# EAGLE design SilovaCast (EAGLE 6.3)
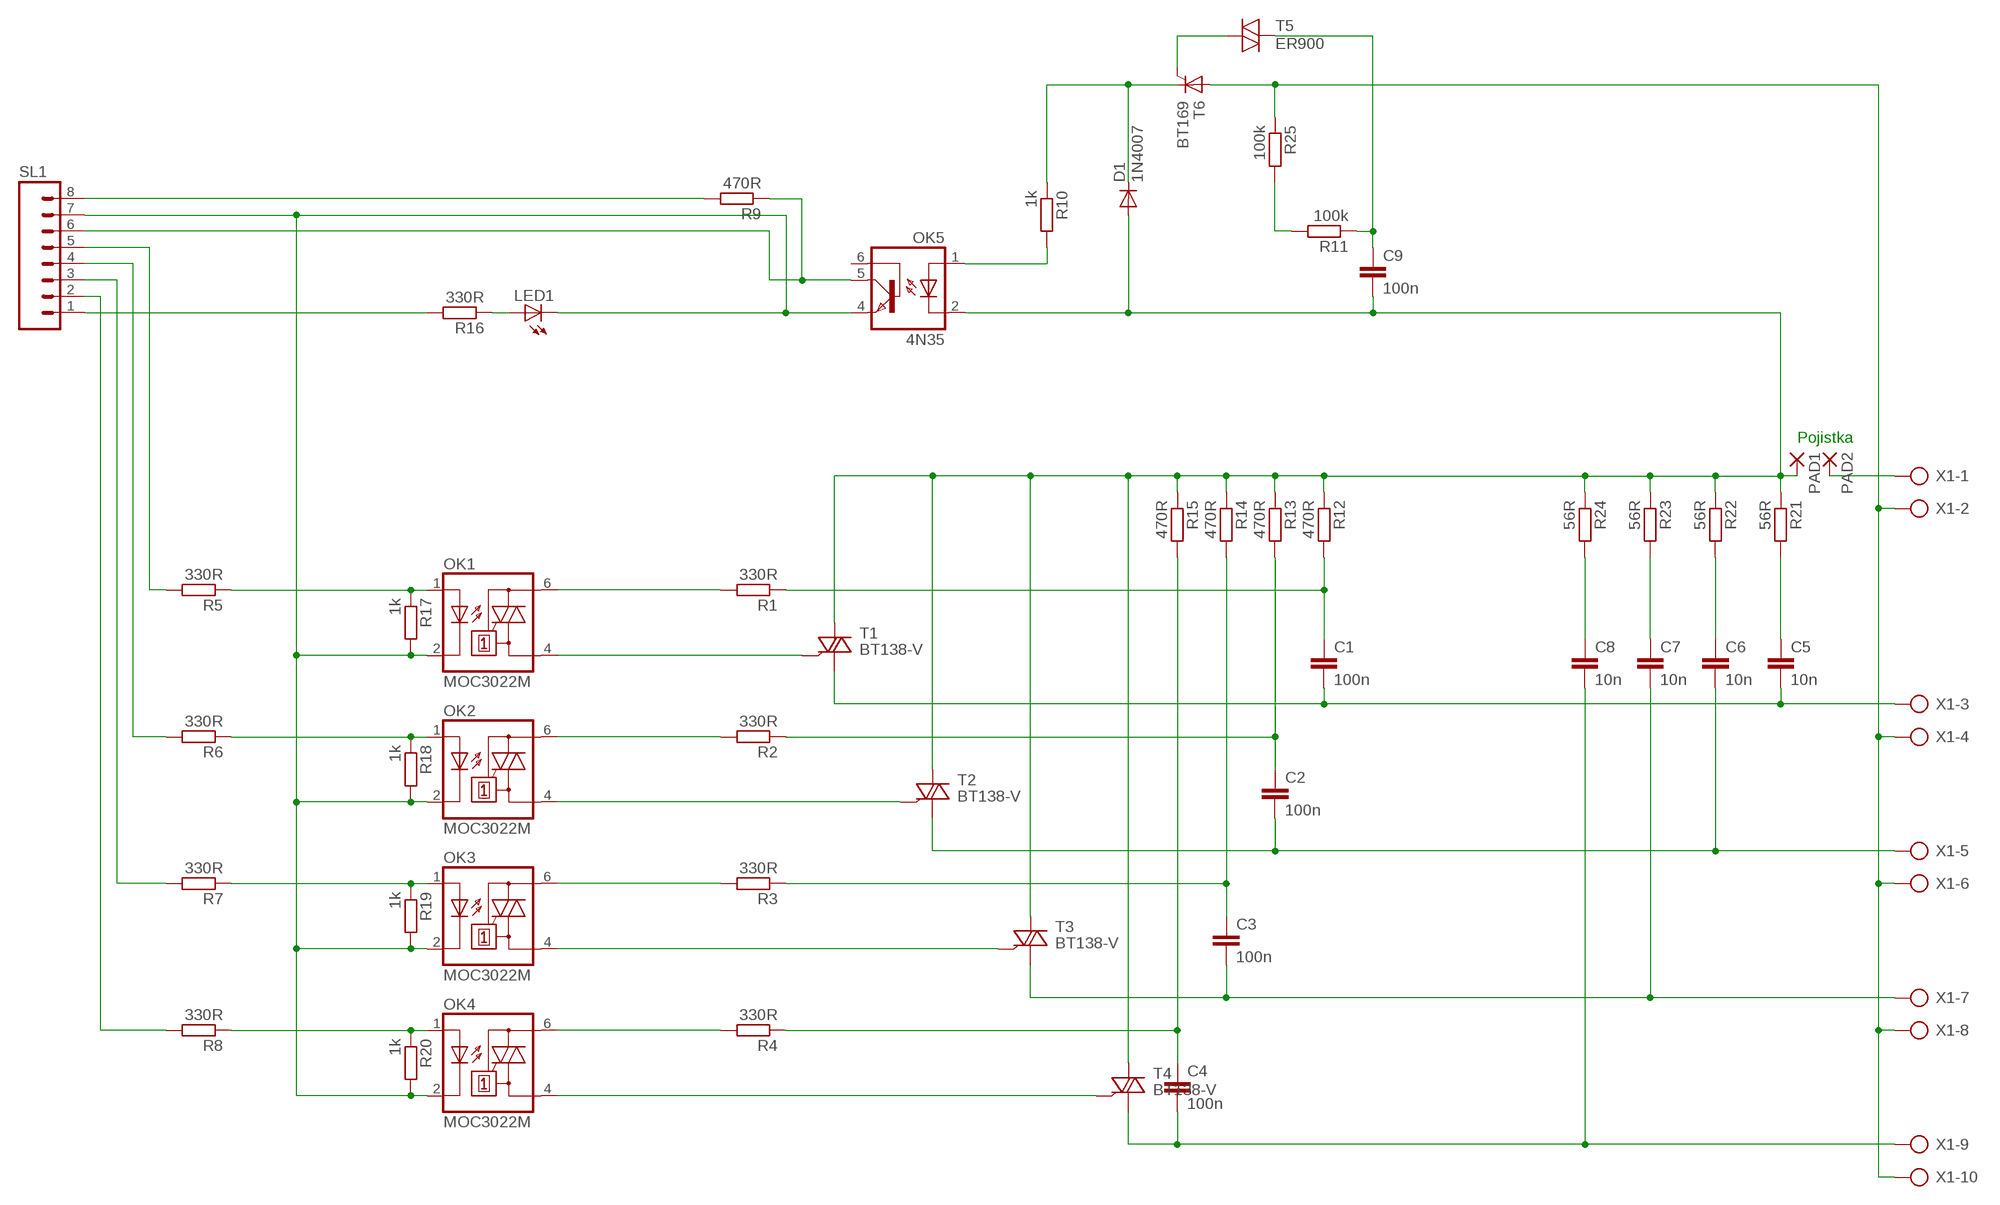
[diagram p0: schematic, sheet 1]

## Parts
C1  100n  C7.5/6  [C7.5B6]
C2  100n  C7.5/6  [C7.5B6]
C3  100n  C7.5/6  [C7.5B6]
C4  100n  C7.5/6  [C7.5B6]
C5  10n  C7.5/6  [C7.5B6]
C6  10n  C7.5/6  [C7.5B6]
C7  10n  C7.5/6  [C7.5B6]
C8  10n  C7.5/6  [C7.5B6]
C9  100n  C7.5/6  [C7.5B6]
D1  1N4007  1N4004  [DO41-10]
LED1  LED5MM  [LED5MM]
OK1  MOC3022M  [DIL06]
OK2  MOC3022M  [DIL06]
OK3  MOC3022M  [DIL06]
OK4  MOC3022M  [DIL06]
OK5  4N35  [DIL06]
PAD1  3,17/1,3  [3,17/1,3]
PAD2  3,17/1,3  [3,17/1,3]
R1  330R  R-EU_0207/12  [0207/12]
R2  330R  R-EU_0207/12  [0207/12]
R3  330R  R-EU_0207/12  [0207/12]
R4  330R  R-EU_0207/12  [0207/12]
R5  330R  R-EU_R0805  [R0805]
R6  330R  R-EU_R0805  [R0805]
R7  330R  R-EU_R0805  [R0805]
R8  330R  R-EU_R0805  [R0805]
R9  470R  R-EU_0207/12  [0207/12]
R10  1k  R-EU_0207/12  [0207/12]
R11  100k  R-EU_0207/12  [0207/12]
R12  470R  R-EU_0207/12  [0207/12]
R13  470R  R-EU_0207/12  [0207/12]
R14  470R  R-EU_0207/12  [0207/12]
R15  470R  R-EU_0207/12  [0207/12]
R16  330R  R-EU_0207/12  [0207/12]
R17  1k  R-EU_R0805  [R0805]
R18  1k  R-EU_R0805  [R0805]
R19  1k  R-EU_R0805  [R0805]
R20  1k  R-EU_R0805  [R0805]
R21  56R  R-EU_0411/15  [0411/15]
R22  56R  R-EU_0411/15  [0411/15]
R23  56R  R-EU_0411/15  [0411/15]
R24  56R  R-EU_0411/15  [0411/15]
R25  100k  R-EU_0207/12  [0207/12]
SL1  M08  [08P]
T1  BT138-V  [TO220BV]
T2  BT138-V  [TO220BV]
T3  BT138-V  [TO220BV]
T4  BT138-V  [TO220BV]
T5  ER900  [ER900]
T6  BT169  [TO92-2]
X1  AK300/10  [AK300/10]

## Nets
L: C9.2 D1.A OK5.2(C) PAD1.1(P) R12.1 R13.1 R14.1 R15.1 R21.1 R22.1 R23.1 R24.1 T1.T2(A2) T2.T2(A2) T3.T2(A2) T4.T2(A2)
N$1: C3.2 C7.2 T3.T1(A1) X1.7
N$2: C4.2 C8.2 T4.T1(A1) X1.9
N$3: C2.2 C6.2 T2.T1(A1) X1.5
N$4: OK3.4(A1) T3.G
N$5: OK4.4(A1) T4.G
N$6: OK2.4(A1) T2.G
N$7: OK1.4(A1) T1.G
N$8: C1.2 C5.2 T1.T1(A1) X1.3
N$9: OK1.6(A2) R1.2
N$10: OK2.6(A2) R2.2
N$11: OK3.6(A2) R3.2
N$12: OK4.6(A2) R4.2
N$13: T5.1 T6.G
N$14: C9.1 R11.1 T5.2
N$15: OK5.1(A) R10.2
N$16: PAD2.1(P) X1.1
N$17: R9.2 SL1.8
N$18: D1.C R10.1 T6.C
N$19: R11.2 R25.2
N$20: C2.1 R2.1 R13.2
N$21: C3.1 R3.1 R14.2
N$22: OK5.5(COL) R9.1 SL1.6
N$23: LED1.K(C) OK1.2(C) OK2.2(C) OK3.2(C) OK4.2(C) OK5.4(EMI) R17.2 R18.2 R19.2 R20.2 SL1.7
N$24: OK1.1(A) R5.1 R17.1
N$25: OK2.1(A) R6.1 R18.1
N$26: OK3.1(A) R7.1 R19.1
N$27: OK4.1(A) R8.1 R20.1
N$28: R5.2 SL1.5
N$29: R6.2 SL1.4
N$30: R7.2 SL1.3
N$31: R8.2 SL1.2
N$32: C4.1 R4.1 R15.2
N$33: C1.1 R1.1 R12.2
N$34: R16.2 SL1.1
N$35: LED1.A R16.1
N$36: C5.1 R21.2
N$37: C6.1 R22.2
N$38: C7.1 R23.2
N$39: C8.1 R24.2
N_PEN: R25.1 T6.A X1.2 X1.4 X1.6 X1.8 X1.10
Unconnected: OK5.6(BAS)

## Notes on the sheet
- Pojistka

## Library data of the parts
C1-C9 = capacitor-wima:C: CAPACITOR naming: grid - package width
D1 = diode:1N4004: DIODE general purpose rectifier, 1 A
LED1 = led:LED: LED OSRAM: - CHIPLED LG R971, LG N971, LY N971, LG Q971, LY Q971, LO R971, LY R971 LH N974, LH R974 LS Q976, LO Q976, LY Q976 LO Q996 - Hyper CHIPLED LW Q18S LB Q993, LB Q99A, LB R99A - SideLED LS A670, LO A670, LY A670, LG A670, LP A670 LB A673, LV A673, LT A673, LW A673 LH A674 LY A675 LS A676, LA A676, LO A676, LY A676, LW A676 LS A679, LY A679, LG A679 - Hyper Micro SIDELED® LS Y876, LA Y876, LO Y876, LY Y876 LT Y87S - SmartLED LW L88C, LW L88S LB L89C, LB L89S, LG L890 LS L89K, LO L89K, LY L89K LS L896, LA L896, LO L896, LY L896 - TOPLED LS T670, LO T670, LY T670, LG T670, LP T670 LSG T670, LSP T670, LSY T670, LOP T670, LYG T670 LG T671, LOG T671, LSG T671 LB T673, LV T673, LT T673, LW T673 LH T674 LS T676, LA T676, LO T676, LY T676, LB T676, LH T676, LSB T676, LW T676 LB T67C, LV T67C, LT T67C, LS T67K, LO T67K, LY T67K, LW E67C LS E67B, LA E67B, LO E67B, LY E67B, LB E67C, LV E67C, LT E67C LW T67C LS T679, LY T679, LG T679 LS T770, LO T770, LY T770, LG T770, LP T770 LB T773, LV T773, LT T773, LW T773 LH T774 LS E675, LA E675, LY E675, LS T675 LS T776, LA T776, LO T776, LY T776, LB T776 LHGB T686 LT T68C, LB T68C - Hyper Mini TOPLED® LB M676 - Mini TOPLED Santana® LG M470 LS M47K, LO M47K, LY M47K Source: http://www.osram.convergy.de LUXEON: - LUMILED® LXK2-PW12-R00, LXK2-PW12-S00, LXK2-PW14-U00, LXK2-PW14-V00 LXK2-PM12-R00, LXK2-PM12-S00, LXK2-PM14-U00 LXK2-PE12-Q00, LXK2-PE12-R00, LXK2-PE12-S00, LXK2-PE14-T00, LXK2-PE14-U00 LXK2-PB12-K00, LXK2-PB12-L00, LXK2-PB12-M00, LXK2-PB14-N00, LXK2-PB14-P00, LXK2-PB14-Q00 LXK2-PR12-L00, LXK2-PR12-M00, LXK2-PR14-Q00, LXK2-PR14-R00 LXK2-PD12-Q00, LXK2-PD12-R00, LXK2-PD12-S00 LXK2-PH12-R00, LXK2-PH12-S00 LXK2-PL12-P00, LXK2-PL12-Q00, LXK2-PL12-R00 Source: www.luxeon.com KINGBRIGHT: KA-3528ASYC Source: www.kingbright.com
OK1-OK4 = optocoupler:MOC30*M: RANDOM-PHASE OPTOISOLATORS TRIAC DRIVER OUTPUT Source: http://www.fairchildsemi.com MOC3020-M.pdf; MF: FAIRCHILD SEMICONDUCTOR; MPN: MOC3022-M; OC_FARNELL: 1021086; OC_NEWARK: 58K1956
OK5 = optocoupler:4N35: MOTOROLA OPTO COUPLER; MF: FAIRCHILD SEMICONDUCTOR; MPN: 4N35; OC_FARNELL: 1328375; OC_NEWARK: 72K9946
PAD1 PAD2 = wirepad:3,17/1,3: THROUGH-HOLE PAD
R1-R25 = rcl:R-EU_: RESISTOR, European symbol
SL1 = con-amp-quick:M08: AMP QUICK CONNECTOR; OC_FARNELL: unknown; OC_NEWARK: unknown
T1-T4 = triac:BT138: TRIAC Source: http://www.semiconductors.philips.com BT138_SERIES_2.pdf
T5 = triac:ER900: TRIGGER DIODE
T6 = triac:BT169: THYRISTOR
X1 = con-ptr500:AK300/10: CONNECTOR; OC_FARNELL: unknown; OC_NEWARK: unknown

## Board
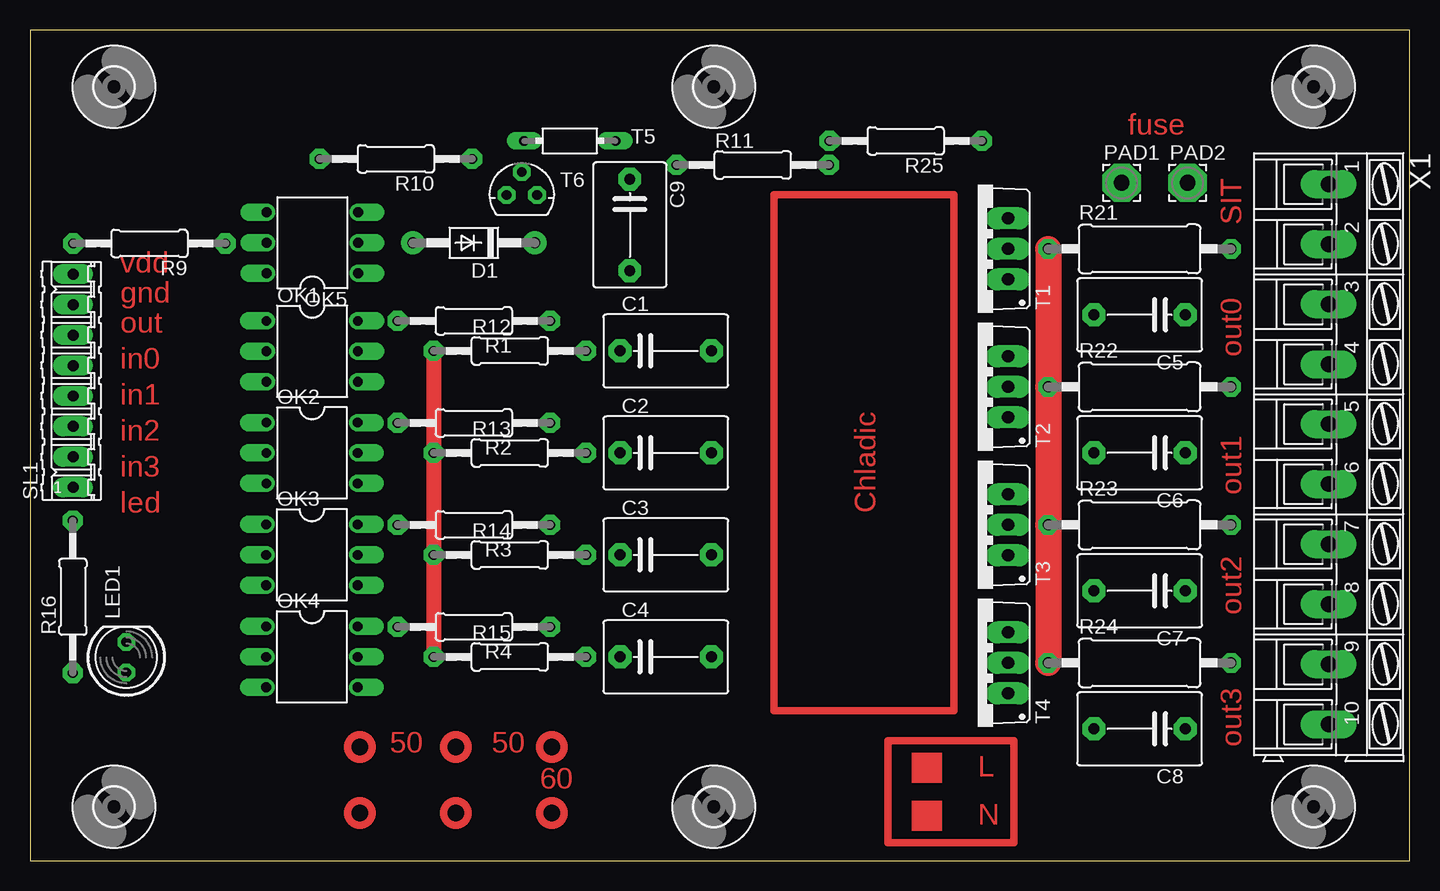
[diagram p1: board, top side]
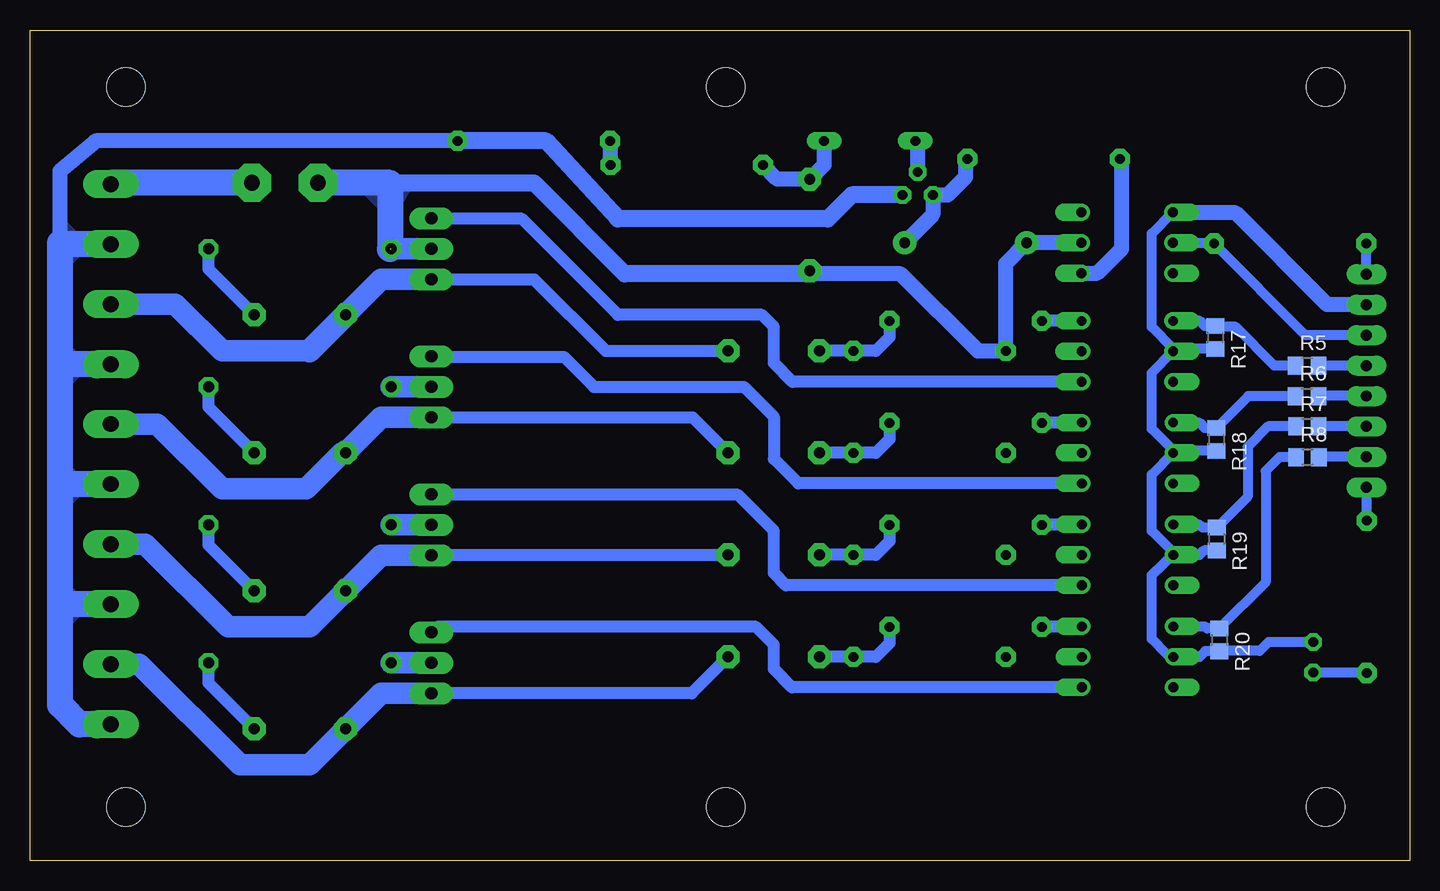
[diagram p2: board, bottom side, seen from below]

Size 115 x 69.24 mm. Coordinates in mm from the lower left corner, seen from the top.
Outline: 0,0 115,0 115,69.24 0,69.24 0,0
Copper layers (1*16): Top 0.035mm / dielectric 1.5mm / Bottom 0.035mm
Design rules "default *": minimum track width 10mil, minimum drill 24mil, track to track 8mil, track to pad 8mil, pad to pad 8mil, via to via 8mil, smd to smd 8mil, copper to edge 40mil, drill to drill 8mil, minimum pad ring 10mil, minimum via ring 8mil, stop-mask expansion 4mil, vias tented up to drill 0mil, thermal gap 10mil

### Footprints (pad centres in the part's own frame; a part is rotated, then mirrored left to right if it is on the bottom)
C7.5B6 = drill 0.914 pad 1.905 octagon: 1 -3.81,0; 2 3.81,0
DO41-10 = drill 0.9 pad 1.93: A 5.08,0; C -5.08,0
LED5MM = drill 0.813 octagon: A -1.27,0; K 1.27,0
DIL06 = drill 0.813 offset: 1 -2.54,-3.81; 2 0,-3.81; 3 2.54,-3.81; 4 2.54,3.81; 5 0,3.81; 6 -2.54,3.81
3,17/1,3 = drill 1.321 pad 3.175 octagon: 1 0,0
0207/12 = drill 0.813 pad 1.676 octagon: 1 -6.35,0; 2 6.35,0
R0805 = smd 1.3 x 1.5: 1 -0.95,0; 2 0.95,0
0411/15 = drill 0.914 octagon: 1 -7.62,0; 2 7.62,0
08P = drill 0.914 long: 1 -8.89,0; 2 -6.35,0; 3 -3.81,0; 4 -1.27,0; 5 1.27,0; 6 3.81,0; 7 6.35,0; 8 8.89,0
TO220BV = drill 1.016 long: G 2.54,-2.54; T1 -2.54,-2.54; T2 0,-2.54
ER900 = drill 0.813 long: 1 -3.81,0; 2 3.81,0
TO92-2 = drill 0.813 octagon: A 1.27,0; C -1.27,0; G 0,1.905
3,2 = hole 3.2: 0,0
AK300/10 = drill 1.321 long: 1 -22.504,0; 2 -17.501,0; 3 -12.497,0; 4 -7.493,0; 5 -2.515,0; 6 2.489,0; 7 7.493,0; 8 12.497,0; 9 17.501,0; 10 22.504,0

### Placement (x,y rotation side)
C1  53,42.5 0 top
C2  53,34 0 top
C3  53,25.5 0 top
C4  53,17 0 top
C5  92.5,45.5 180 top
C6  92.5,34 180 top
C7  92.5,22.5 180 top
C8  92.5,11 180 top
C9  50,53 270 top
D1  37,51.5 180 top
LED1  8.03,16.96 90 top
OK1  23.52,42.46 270 top
OK2  23.51,33.99 270 top
OK3  23.5,25.5 270 top
OK4  23.5,17 270 top
OK5  23.54,51.51 90 top
PAD1  91,56.5 0 top
PAD2  96.5,56.5 0 top
R1  37,45 180 top
R2  37,36.5 180 top
R3  37,28 180 top
R4  37,19.5 180 top
R5  8.55,41.28 0 bottom
R6  8.54,38.73 0 bottom
R7  8.52,36.2 0 bottom
R8  8.51,33.65 0 bottom
R9  9.95,51.45 180 top
R10  30.5,58.5 180 top
R11  60.25,58 0 top
R12  40,42.5 0 top
R13  40,34 0 top
R14  40,25.5 0 top
R15  40,17 0 top
R16  3.57,22.01 90 top
R17  16.19,43.62 270 bottom
R18  16.11,35.12 270 bottom
R19  16.08,26.82 270 bottom
R20  15.85,18.42 270 bottom
R21  92.5,51 0 top
R22  92.5,39.5 0 top
R23  92.5,28 0 top
R24  92.5,16.5 0 top
R25  73,60 180 top
SL1  3.59,40.01 90 top
T1  79,51 90 top
T2  79,39.5 90 top
T3  79,28 90 top
T4  79,16.5 90 top
T5  45,60 0 top
T6  41,55.5 0 top
U$1  [3,2]  7,4.5 0 top
U$2  [3,2]  107,4.5 0 top
U$3  [3,2]  7,64.5 0 top
U$4  [3,2]  107,64.5 0 top
U$5  [3,2]  57,64.5 0 top
U$6  [3,2]  57,4.5 0 top
X1  108.26,33.89 270 top

### Tracks (layer width: path | path; a pad name or v marks a point on that pad's centre or on a via)
L  (1 unrouted)
  Top 1.27: R12.1 R13.1 R14.1 R15.1
  Top 2.184: R21.1 R22.1 R23.1 R24.1
  Bottom 0.813: 84.88,51.38 R21.1
  Bottom 1.016: D1.A
  Bottom 1.27: OK5.2 D1.A | D1.A 33.65,49.77 R12.1 36,42.5 42.42,48.92 49.73,48.92 C9.2 50.27,48.92
  Bottom 1.422: 85,56.5 73,56.5 65.42,48.92 50.27,48.92
  Bottom 1.778: T4.T2 R24.1 | T3.T2 R23.1 | T2.T2 R22.1 | T1.T2 R21.1
  Bottom 2.184: 85,51 85,56.5 PAD1.1
  pour Bottom: 85,54 87.5,56.5 83.5,56.5
N$1
  Bottom 1.016: C3.2 56.85,25.46 T3.T1
  Bottom 1.778: T3.T1 85.73,25.46 C7.2 91.69,19.5 98.5,19.5 105.4,26.4 X1.7
N$2
  Bottom 1.016: C4.2 59.85,13.96 T4.T1
  Bottom 1.778: T4.T1 85.73,13.96 C8.2 91.69,8 97.5,8 105.89,16.39 X1.9
N$3
  Bottom 1.016: T2.T1 59.77,36.96 C2.2
  Bottom 1.27: C6.2 89,34
  Bottom 1.778: T2.T1 85.73,36.96 C6.2 | 89,34 92,31 99,31 104.41,36.41 X1.5
N$4
  Bottom 0.813: 81.5,30.5 T3.G
  Bottom 1.016: OK3.4 51.96,22.96 53,24 53,27.5 56,30.5 81.5,30.5
N$5
  Bottom 1.016: OK4.4 51.46,14.46 53,16 53,18 54.5,19.5 81.08,19.5 T4.G
N$6
  Bottom 0.813: 81.5,42 T2.G
  Bottom 1.016: OK2.4 50.95,31.45 53,33.5 53,37 55.5,39.5 68,39.5 70.5,42 81.5,42
N$7
  Bottom 0.813: 81.5,53.5 T1.G
  Bottom 1.016: OK1.4 51.42,39.92 53,41.5 53,44.5 54,45.5 66,45.5 74,53.5 81.5,53.5
N$8
  Bottom 1.016: T1.T1 72.96,48.46 67,42.5 C1.2
  Bottom 1.778: T1.T1 85.73,48.46 C5.2 | X1.3 102.89,46.39 99,42.5 91.69,42.5
  Bottom 1.93: 91.69,42.5 C5.2
N$9
  Bottom 1.016: OK1.6 R1.2
N$10
  Bottom 1.016: OK2.6 27.35,36.5 R2.2
N$11
  Bottom 1.016: OK3.6 27.35,28 R3.2
N$12
  Bottom 1.016: OK4.6 27.35,19.5 R4.2
N$13
  Bottom 1.27: T6.G 41,59.81 T5.1
N$14
  Bottom 1.27: T5.2 48.81,58 C9.1 52.71,56.81 R11.1
N$15
  Bottom 1.27: OK5.1 26.03,48.97 24,51 24,58.38 R10.2
N$16
  Bottom 2.184: PAD2.1 108.26,56.5 X1.1
N$17
  Bottom 0.406: R9.2
  Bottom 0.813: SL1.8 R9.2
N$18
  Bottom 1.27: D1.C 39.73,53.85 T6.C 38.5,55.5 37,57 37,58.35 R10.1
N$19
  Bottom 1.27: R11.2 66.6,59.95 R25.2
N$20
  Bottom 1.016: C2.1 R13.2 44.5,34 43.35,35.15 R2.1
N$21
  Bottom 1.016: C3.1 R14.2 44.5,25.5 43.35,26.65 R3.1
N$22
  Bottom 0.813: SL1.6 8.67,43.82 R9.1 19.67,51.45 OK5.5
N$23
  Bottom 0.406: OK3.2 19.66,25.66 | OK2.2 19.7,34.2 | OK1.2 19.71,42.71 | 19.68,54 OK5.4
  Bottom 0.813: 19.66,25.66 21.5,27.5 21.5,32.19 OK2.2 19.7,34.17 R18.2 | 19.7,34.2 21.5,36 21.5,40.67 OK1.2 19.5,42.67 R17.2 | 19.71,42.71 21.5,44.5 21.5,52.28 OK5.4 | LED1.K 11.77,18.23 12.5,17.5 15.82,17.5 R20.2 17.03,17.47 17.5,17 OK4.2 20.23,17.23 21.5,18.5 21.5,23.81 OK3.2 17.5,25.5 17.13,25.87 R19.2
  Bottom 1.27: SL1.7 6.86,46.36 14.5,54 19.68,54
N$24
  Bottom 0.406: 15.62,44.5 R17.1
  Bottom 0.813: R5.1 11.28,41.28 14.5,44.5 15.62,44.5 | R17.1 17.07,44.57 17.5,45 OK1.1
N$25
  Bottom 0.813: R6.1 13.45,38.73 R18.1 17.07,36.07 17.5,36.5 19.67,36.5 OK2.1
N$26
  Bottom 0.813: R7.1 11.8,36.2 13.5,34.5 13.5,30.35 R19.1 17.27,27.77 17.5,28 19.65,28 OK3.1
N$27
  Bottom 0.813: R8.1 10.85,33.65 12,32.5 12,23.22 R20.1 16.87,19.37 17,19.5 19.65,19.5 OK4.1
N$28
  Bottom 0.813: SL1.5 R5.2
N$29
  Bottom 0.406: R6.2
  Bottom 0.813: SL1.4 R6.2
N$30
  Bottom 0.813: SL1.3 R7.2
N$31
  Bottom 0.406: R8.2
  Bottom 0.813: SL1.2 R8.2
N$32
  Bottom 1.016: C4.1 R15.2 44.5,17 43.35,18.15 R4.1
N$33
  Bottom 1.016: C1.1 R12.2 44.5,42.5 43.35,43.65 R1.1
N$34
  Bottom 0.406: 3.57,31.1 SL1.1
  Bottom 0.813: R16.2 3.57,31.1
N$35
  Bottom 0.406: 8,15.66 LED1.A
  Bottom 0.813: R16.1 8,15.66
N$36
  Bottom 1.016: C5.1 100.12,49.31 R21.2
N$37
  Bottom 1.016: C6.1 100.12,37.81 R22.2
N$38
  Bottom 1.016: C7.1 100.12,26.31 R23.2
N$39
  Bottom 1.016: C8.1 100.12,14.81 R24.2
N$40
  Top 0.61: 82,1.5 82,10 71.5,10 71.5,1.5 82,1.5
N$41
  Top 0.61: 62,13.5 62,14.5 62,55.5 77,55.5 77,12.5 62,12.5 62,13.5
N_PEN
  Bottom 1.27: 109.75,59.8 112.5,57.5 112.5,51.5 112.39,51.39 | 109.75,59.8 109.5,60 | 112.12,41.38 112.5,41 | 112.1,31.4 112.5,31 | 112.39,21.39 112.5,21.5 | R25.1 109.54,60 109.75,59.8
  Bottom 1.422: T6.A 46.5,55.5 48.5,53.5 66,53.5 72,60 R25.1
  Bottom 2.184: X1.10 110.89,11.39 112.5,13 112.5,21.5 112.5,31 112.5,41 112.5,51.5 | X1.2 112.39,51.39 | X1.4 112.12,41.38 | X1.6 112.1,31.4 | X1.8 112.39,21.39
  pour Bottom: 110.5,41 112.5,39 112.5,43.5 110.5,41.5
  pour Bottom: 110.5,31 112.5,29 112.5,33.5 110.5,31.5
  pour Bottom: 110.5,21 112.5,19 112.5,23.5 110.5,21.5
  pour Bottom: 110.5,51 112.5,49 112.5,53.5 110.5,51.5
(copper drawn outside any net)
  shapes: Top area x2, Top circle x6

### Text on the board
Top: fuse | SIT | vdd | gnd | out | out0 | in0 | in1 | in2 | in3 | out1 | led | Chladic | out2 | out3 | 50 | 50 | L | 60 | N